# Altium schematic sheet VoltageAmplifier.SchDoc
size B
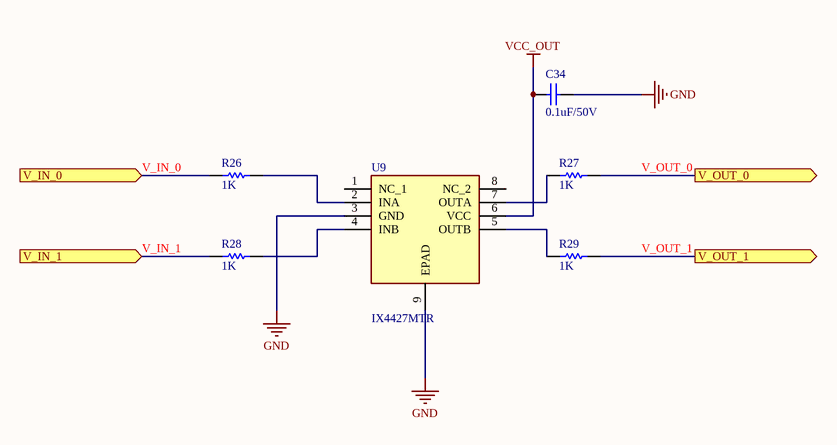
[diagram p0: VoltageAmplifier.SchDoc]

## Parts
C34  0.1uF/50V  [RAD-0.3]
R26  1K  [AXIAL-0.3]
R27  1K  [AXIAL-0.3]
R28  1K  [AXIAL-0.3]
R29  1K  [AXIAL-0.3]
U9  IX4427MTR  [SON65P300X300X90-9N]

## Ports
V_IN_0 (in), V_IN_1 (in), V_OUT_0 (out), V_OUT_1 (out)

## Nets
GND: C34.2 U9.3(GND) U9.9(EPAD)
VCC_OUT: C34.1 U9.6(VCC)
V_IN_0: R26.1 ; port V_IN_0
V_IN_1: R28.1 ; port V_IN_1
V_OUT_0: R27.2 ; port V_OUT_0
V_OUT_1: R29.2 ; port V_OUT_1
NetR26_2: R26.2 U9.2(INA)
NetR27_1: R27.1 U9.7(OUTA)
NetR28_2: R28.2 U9.4(INB)
NetR29_1: R29.1 U9.5(OUTB)

Not connected (* = marked no-connect by the designer): U9 1(NC_1) 8(NC_2)

## Library data of the parts
C34 = Cap: Capacitor; Published: 8-Jun-2000; LatestRevisionDate: 17-Jul-2002; LatestRevisionNote: Re-released for DXP Platform.; PackageReference: RAD-0.3; Publisher: Altium Limited; PackageDescription: Radial Cap, Thru-Hole; 2 Leads; 0.3 in Pin Spacing; Value: 0.1uF/50V
R26-R29 = Res1: Resistor; Published: 8-Jun-2000; LatestRevisionDate: 17-Jul-2002; LatestRevisionNote: Re-released for DXP Platform.; PackageReference: AXIAL-0.3; Publisher: Altium Limited; PackageDescription: Axial Device, Thru-Hole; 2 Leads; 0.3 in Pin Spacing; Value: 1K
U9 = IX4427MTR: Integrated Circuit; Manufacturer_Name: IXYS SEMICONDUCTOR; Datasheet Link: http://www.ixysic.com/home/pdfs.nsf/www/IX4426-27-28.pdf/$file/IX4426-27-28.pdf; Height: 0.9mm; Manufacturer_Part_Number: IX4427MTR; Arrow Part Number: IX4427MTR; Arrow Price/Stock: https://www.arrow.com/en/products/ix4427mtr/ixys; Mouser Part Number: 849-IX4427MTR; Mouser Price/Stock: https://www.mouser.co.uk/ProductDetail/IXYS-Integrated-Circuits/IX4427MTR/?qs=KD90HyCcfIn4cdMeKdxOsg%3D%3D